# EAGLE design GPS_Shield (EAGLE 7.1.0)
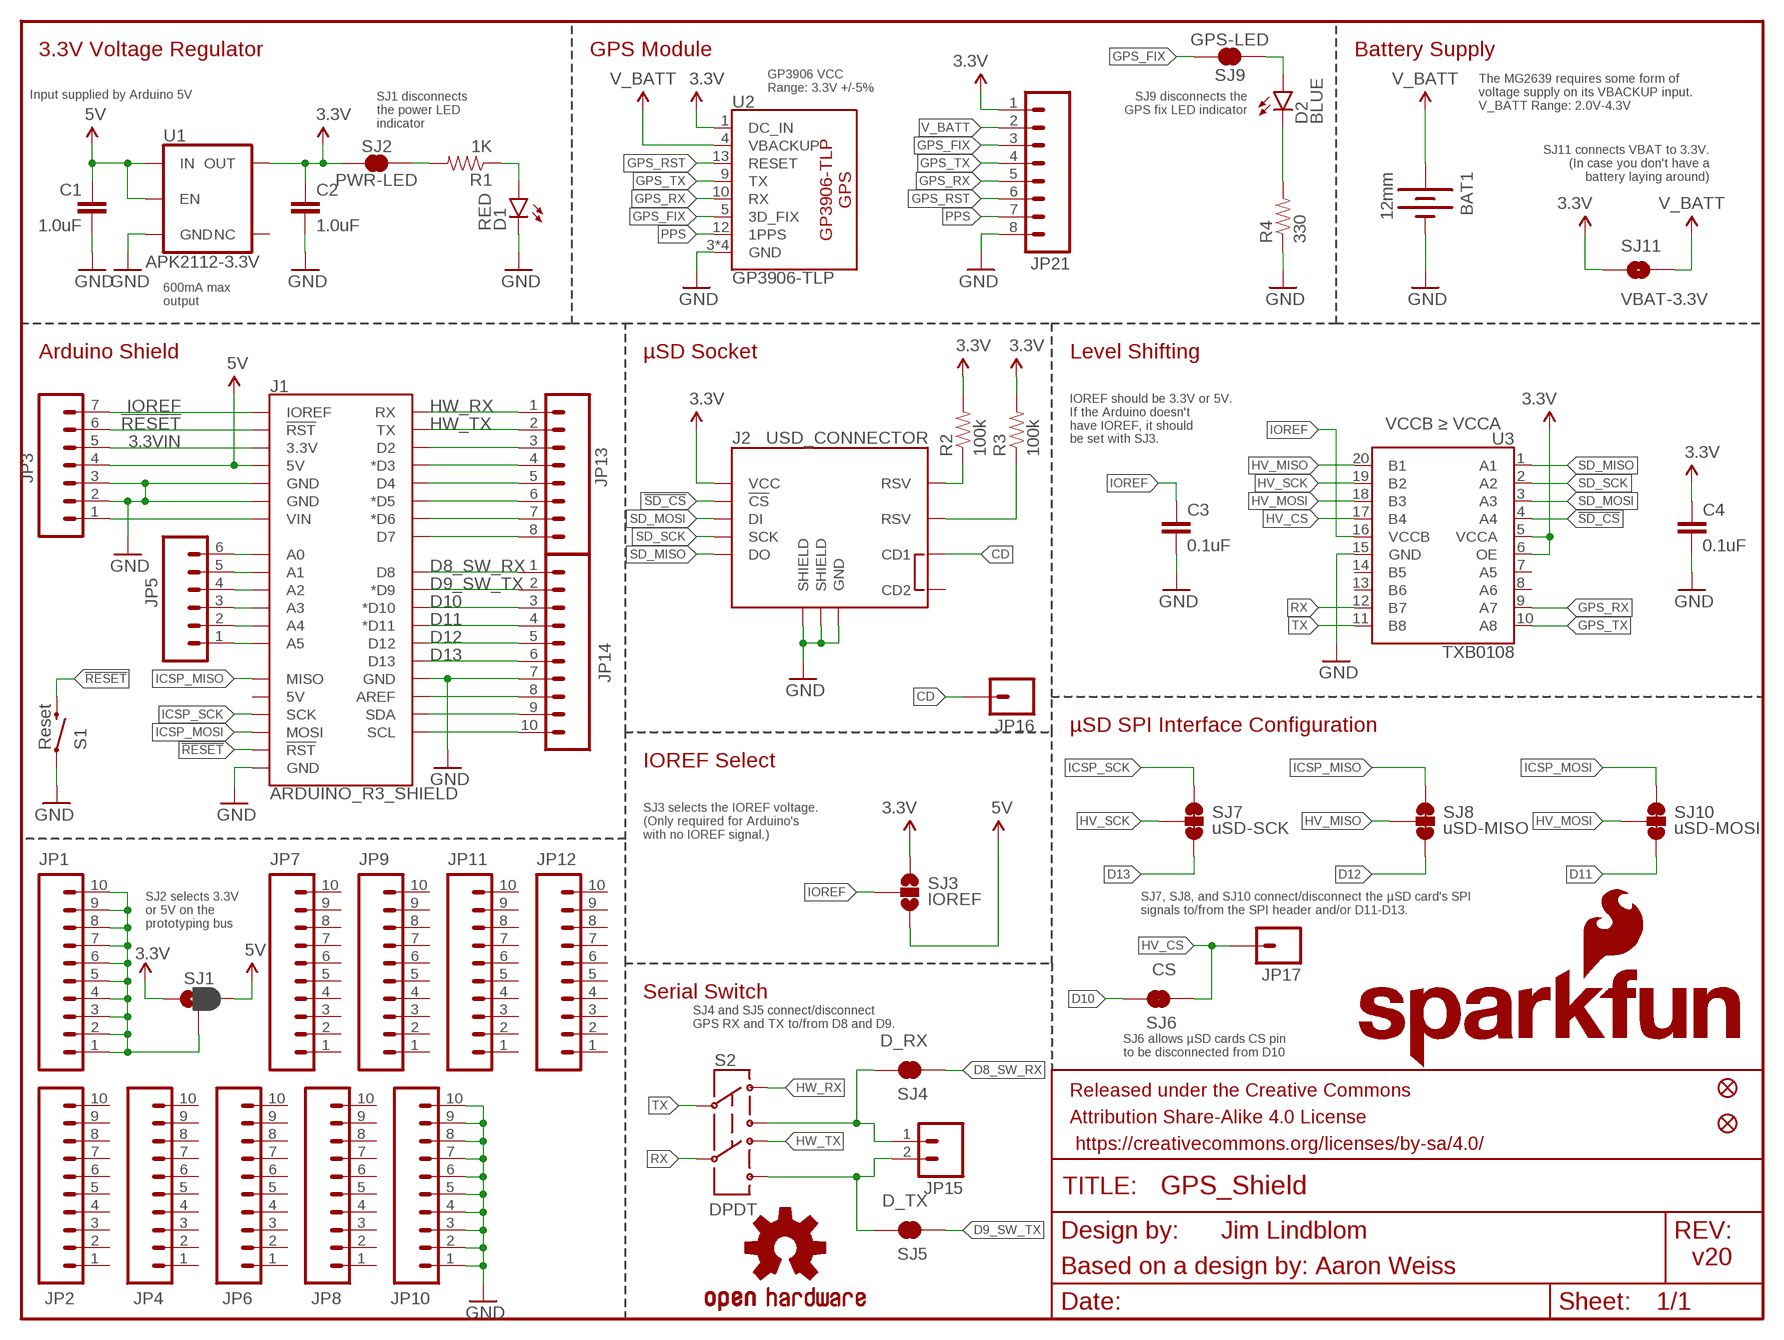
[diagram p0: schematic, sheet 1]

## Parts
BAT1  12mm  BATTERY12MM  [BATTCON_12MM]
C1  1.0uF  1.0UF-16V-10%(0603)  [0603-CAP]
C2  1.0uF  1.0UF-16V-10%(0603)  [0603-CAP]
C3  0.1uF  0.1UF-25V(+80/-20%)(0603)  [0603-CAP]
C4  0.1uF  0.1UF-25V(+80/-20%)(0603)  [0603-CAP]
D1  RED  LED-RED0603  [LED-0603]
D2  BLUE  LED-BLUE0603  [LED-0603]
FRAME1  FRAME-LETTER  [CREATIVE_COMMONS]
J1  ARDUINO_R3_SHIELD  ARDUINO_R3_SHIELD_ICSP-NO_LABELS  [UNO_R3_SHIELD_ICSP_NOLABELS]
J2  USD_CONNECTOR  [MICRO-SD-SOCKET-PP]
JP1  M10NO_SILK_PTH_FEMALE  [1X10_NO_SILK]
JP2  M10NO_SILK_PTH_FEMALE  [1X10_NO_SILK]
JP3  M07NO_SILK  [1X07_NO_SILK]
JP4  M10NO_SILK_PTH_FEMALE  [1X10_NO_SILK]
JP5  M06NO_SILK_FEMALE_PTH  [1X06_NO_SILK]
JP6  M10NO_SILK_PTH_FEMALE  [1X10_NO_SILK]
JP7  M10NO_SILK_PTH_FEMALE  [1X10_NO_SILK]
JP8  M10NO_SILK_PTH_FEMALE  [1X10_NO_SILK]
JP9  M10NO_SILK_PTH_FEMALE  [1X10_NO_SILK]
JP10  M10NO_SILK_PTH_FEMALE  [1X10_NO_SILK]
JP11  M10NO_SILK_PTH_FEMALE  [1X10_NO_SILK]
JP12  M10NO_SILK_PTH_FEMALE  [1X10_NO_SILK]
JP13  M08NO_SILK_FEMALE_PTH  [1X08_NO_SILK]
JP14  M10NO_SILK_PTH_FEMALE  [1X10_NO_SILK]
JP15  M021X02_NO_SILK  [1X02_NO_SILK]
JP16  M01PTH_NO_SILK_YES_STOP  [1X01_NO_SILK]
JP17  M01PTH_NO_SILK_YES_STOP  [1X01_NO_SILK]
JP19  FIDUCIAL1X2  [FIDUCIAL-1X2]
JP20  FIDUCIAL1X2  [FIDUCIAL-1X2]
JP21  M08NO_SILK_FEMALE_PTH  [1X08_NO_SILK]
LOGO1  OSHW-LOGOM  [OSHW-LOGO-M]
LOGO2  SFE_LOGO_NAME_FLAME.1_INCH  [SFE_LOGO_NAME_FLAME_.1]
R1  1K  1KOHM-1/10W-1%(0603)  [0603-RES]
R2  100k  100KOHM-1/10W-1%(0603)  [0603-RES]
R3  100k  100KOHM-1/10W-1%(0603)  [0603-RES]
R4  330  330OHM1/10W1%(0603)  [0603-RES]
S1  Reset  SWITCH-MOMENTARY-2SMD  [TACTILE-SWITCH-SMD]
S2  DPDT  SWITCH-DPDTAYZ0202  [AYZ0202]
SJ1  JUMPER-PAD-3-2OF3_NC_BY_PASTE  [PAD-JUMPER-3-2OF3_NC_BY_PASTE_YES_SILK_FULL_BOX]
SJ2  PWR-LED  JUMPER-PAD-2-NC_BY_TRACE  [PAD-JUMPER-2-NC_BY_TRACE_YES_SILK]
SJ3  IOREF  JUMPER-PAD-3-NOYES_SILK  [PAD-JUMPER-3-NO_YES_SILK]
SJ4  D_RX  JUMPER-PAD-2-NC_BY_TRACE  [PAD-JUMPER-2-NC_BY_TRACE_YES_SILK]
SJ5  D_TX  JUMPER-PAD-2-NC_BY_TRACE  [PAD-JUMPER-2-NC_BY_TRACE_YES_SILK]
SJ6  CS  JUMPER-PAD-2-NC_BY_TRACE  [PAD-JUMPER-2-NC_BY_TRACE_YES_SILK]
SJ7  uSD-SCK  JUMPER-PAD-3-NC_BY_TRACE  [PAD-JUMPER-3-3OF3_NC_BY_TRACE_YES_SILK_FULL_BOX]
SJ8  uSD-MISO  JUMPER-PAD-3-NC_BY_TRACE  [PAD-JUMPER-3-3OF3_NC_BY_TRACE_YES_SILK_FULL_BOX]
SJ9  GPS-LED  JUMPER-PAD-2-NC_BY_TRACE  [PAD-JUMPER-2-NC_BY_TRACE_YES_SILK]
SJ10  uSD-MOSI  JUMPER-PAD-3-NC_BY_TRACE  [PAD-JUMPER-3-3OF3_NC_BY_TRACE_YES_SILK_FULL_BOX]
SJ11  VBAT-3.3V  JUMPER-PAD-2-NOYES_SILK  [PAD-JUMPER-2-NO_YES_SILK]
U1  APK2112-3.3V  V_REG_AP2112K-3.3V  [SOT23-5]
U2  GP3906-TLP  [GP3906-TLP]
U3  TXB0108  [UFDFN-20]

## Nets
3.3V: C2.1 C4.1 J2.VCC JP21.1 R2.2 R3.2 SJ1.1 SJ2.1 SJ3.1 SJ11.1 U1.5(OUT) U2.1(DC_IN) U3.5(VCCA) U3.6(OE)
3.3VIN: J1.3.3V JP3.5
5V: C1.1 J1.5V JP3.4 SJ1.3 SJ3.3 U1.1(IN) U1.3(EN)
!RESET!: J1.RES(!RST!) J1.RST_ICSP(!RST!) JP3.6 S1.3
!SD_CS!: J2.CS(!CS) U3.4(A4)
CD: J2.CD1 JP16.1
D8_SW_RX: J1.D8 JP14.1 SJ4.1
D9_SW_TX: J1.D9(*D9) JP14.2 SJ5.1
D10: J1.D10(*D10) JP14.3 SJ6.2
D11: J1.D11(*D11) JP14.4 SJ10.3
D12: J1.D12 JP14.5 SJ8.3
D13: J1.D13 JP14.6 SJ7.3
GND: BAT1.GND(-) C1.2 C2.2 C3.2 C4.2 D1.C J1.GND@0(GND) J1.GND@1(GND) J1.GND@2(GND) J1.GND_ICSP(GND) J2.GND J2.GND1(SHIELD) J2.GND3(SHIELD) JP3.2 JP3.3 JP10.1 JP10.2 JP10.3 JP10.4 JP10.5 JP10.6 JP10.7 JP10.8 JP10.9 JP10.10 JP14.7 JP21.8 R4.1 S1.1 U1.2(GND) U2.3(GND) U2.8(GND) U2.11(GND) U2.20(GND) U3.15(GND)
GPS_FIX: JP21.3 SJ9.2 U2.5(3D_FIX)
GPS_RST: JP21.6 U2.13(RESET)
GPS_RX: JP21.5 U2.10(RX) U3.9(A7)
GPS_TX: JP21.4 U2.9(TX) U3.10(A8)
HV_CS: JP17.1 SJ6.1 U3.17(B4)
HV_MISO: SJ8.2 U3.20(B1)
HV_MOSI: SJ10.2 U3.18(B3)
HV_SCK: SJ7.2 U3.19(B2)
HW_RX: J1.RX JP13.1 S2.1
HW_TX: J1.TX JP13.2 S2.4
ICSP_MISO: J1.MISO SJ8.1
ICSP_MOSI: J1.MOSI SJ10.1
ICSP_SCK: J1.SCK SJ7.1
IOREF: C3.1 J1.IOREF JP3.7 SJ3.2 U3.16(VCCB)
N$1: D1.A R1.1
N$2: D2.C R4.2
N$3: J1.A5 JP5.1
N$4: J1.A4 JP5.2
N$5: J1.D2 JP13.3
N$6: J1.D3(*D3) JP13.4
N$7: J1.D4 JP13.5
N$8: J1.D5(*D5) JP13.6
N$9: J1.D6(*D6) JP13.7
N$10: J1.D7 JP13.8
N$11: J1.A3 JP5.3
N$12: J1.A2 JP5.4
N$13: J1.A1 JP5.5
N$14: J1.A0 JP5.6
N$15: R1.2 SJ2.2
N$16: JP1.1 JP1.2 JP1.3 JP1.4 JP1.5 JP1.6 JP1.7 JP1.8 JP1.9 JP1.10 SJ1.2
N$17: D2.A SJ9.1
N$18: J2.RSV1(RSV) R2.1
N$19: J2.RSV2(RSV) R3.1
N$20: J1.AREF JP14.8
N$21: J1.SDA JP14.9
N$22: J1.SCL JP14.10
N$24: J1.VIN JP3.1
N$121: JP15.2 S2.6 SJ5.2
N$122: JP15.1 S2.3 SJ4.2
PPS: JP21.7 U2.12(1PPS)
RX: S2.5 U3.12(B7)
SD_MISO: J2.DO U3.1(A1)
SD_MOSI: J2.DI U3.3(A3)
SD_SCK: J2.SCLK(SCK) U3.2(A2)
TX: S2.2 U3.11(B8)
V_BATT: BAT1.PWR@1(+) JP21.2 SJ11.2 U2.4(VBACKUP)
Unconnected: J1.5V_ICSP(5V) J2.CD2 JP2.1 JP2.2 JP2.3 JP2.4 JP2.5 JP2.6 JP2.7 JP2.8 JP2.9 JP2.10 JP4.1 JP4.2 JP4.3 JP4.4 JP4.5 JP4.6 JP4.7 JP4.8 JP4.9 JP4.10 JP6.1 JP6.2 JP6.3 JP6.4 JP6.5 JP6.6 JP6.7 JP6.8 JP6.9 JP6.10 JP7.1 JP7.2 JP7.3 JP7.4 JP7.5 JP7.6 JP7.7 JP7.8 JP7.9 JP7.10 JP8.1 JP8.2 JP8.3 JP8.4 JP8.5 JP8.6 JP8.7 JP8.8 JP8.9 JP8.10 JP9.1 JP9.2 JP9.3 JP9.4 JP9.5 JP9.6 JP9.7 JP9.8 JP9.9 JP9.10 JP11.1 JP11.2 JP11.3 JP11.4 JP11.5 JP11.6 JP11.7 JP11.8 JP11.9 JP11.10 JP12.1 JP12.2 JP12.3 JP12.4 JP12.5 JP12.6 JP12.7 JP12.8 JP12.9 JP12.10 U1.4(NC) U3.7(A5) U3.8(A6) U3.13(B6) U3.14(B5)

## Notes on the sheet
- 3.3V Voltage Regulator | GPS Module | Battery Supply
- The MG2639 requires some form of 
  voltage supply on its VBACKUP input.
  V_BATT Range: 2.0V-4.3V
- GP3906 VCC 
  Range: 3.3V +/-5%
- SJ9 disconnects the
  GPS fix LED indicator
- Input supplied by Arduino 5V
- SJ1 disconnects 
  the power LED 
  indicator
- SJ11 connects VBAT to 3.3V.
  (In case you don't have a
   battery laying around)
- 600mA max
  output
- Arduino Shield | µSD Socket | Level Shifting
- IOREF should be 3.3V or 5V.
  If the Arduino doesn't
  have IOREF, it should
  be set with SJ3.
- VCCB ≥ VCCA
- µSD SPI Interface Configuration
- IOREF Select
- SJ3 selects the IOREF voltage.
  (Only required for Arduino's
  with no IOREF signal.)
- SJ2 selects 3.3V
  or 5V on the
  prototyping bus
- SJ7, SJ8, and SJ10 connect/disconnect the µSD card's SPI 
  signals to/from the SPI header and/or D11-D13.
- Serial Switch
- SJ4 and SJ5 connect/disconnect 
  GPS RX and TX to/from D8 and D9.
- SJ6 allows µSD cards CS pin 
  to be disconnected from D10
- Jim Lindblom
- v20
- Based on a design by: Aaron Weiss

## Library data of the parts
BAT1 = SparkFun-Electromechanical:BATTERY: Battery Holders Various common sizes : AA, AAA, 18650 (PRT-12895), 20mm coin cell and 12mm coin cell. 20MM_4LEGS, BATT-10373; PROD_ID: BATT-08044
C1 C2 = SparkFun-Capacitors:1.0UF-16V-10%(0603): CAP-00868; PROD_ID: CAP-00868
C3 C4 = SparkFun-Capacitors:0.1UF-25V(+80/-20%)(0603): CAP-00810 Ceramic Standard decoupling cap; PROD_ID: CAP-00810
D1 = SparkFun-LED:LED-RED: Assorted Red LEDs LilyPad 1206- DIO-09912 1206- DIO-00809 0603- DIO-00819 "SMART" means more efficient and expensive; PROD_ID: DIO-00819
D2 = SparkFun-LED:LED-BLUE: Blue LEDs for production use Various blue LEDs stocked by SparkFun production 0603 - DIO-08575 Rebel - DIO-09553 1206 - DIO-09911; PROD_ID: DIO-08575
FRAME1 = SparkFun-Aesthetics:FRAME-LETTER: Schematic Frame Standard 8.5x11 US Letter frame
J1 = SparkFun-Boards:ARDUINO_R3_SHIELD_ICSP: Arduino R3 Shield Footprint w/ 6-pin (2x3) ICSP Header
J2 = SparkFun-Connectors:USD_CONNECTOR: microSD Socket Push-push type µSD socket. Footprint production proven. Symbol has new and improved layout and naming accuracy. SparkFun Electronics SKU : PRT-00127. tDoc lines correctly indicate media card edge positions when inserting (unlocked, locked, depressed). NOTE: CD1 and CD2 are connected internally; PROD_ID: CONN-07820
JP1 JP2 JP4 JP6-JP12 JP14 = SparkFun-Connectors:M10: Header 10 Standard 10-pin 0.1" header. Use with straight break away headers (SKU : PRT-00116), right angle break away headers (PRT-00553), swiss pins (PRT-00743), machine pins (PRT-00117), and female headers (PRT-00115).; PROD_ID: CONN-11563
JP3 = SparkFun-Connectors:M07: Header 7 Standard 7-pin 0.1" header. Use with straight break away headers (SKU : PRT-00116), right angle break away headers (PRT-00553), swiss pins (PRT-00743), machine pins (PRT-00117), and female headers (PRT-00115). NOTES ON THE VARIANTS LOCK and LOCK_LONGPADS... This footprint was designed to help hold the alignment of a through-hole component (i.e. 7-pin header) while soldering it into place. You may notice that each hole has been shifted either up or down by 0.005 of an inch from it's more standard position (which is usually a perfectly straight line). This slight alteration caused the pins (the squares in the middle) to touch the edges of the holes. Because they are alternating, it causes a "brace" to hold the header in place. 0.005 has proven to be the perfect amount of "off-center" position when using our standard breakaway headers. Although looks a little odd when you look at the bare footprint, once you have a header in there, the alteration is very hard to notice. Also, if you push a header all the way into place, it is covered up entirely on the bottom side. This idea of altering the position of holes to aid alignment will be further integrated into the Sparkfun Library for other footprints. It can help hold any component with 3 or more connection pins.
JP5 = SparkFun-Connectors:M06: Header 6 Standard 6-pin 0.1" header. Use with straight break away headers (SKU : PRT-00116), right angle break away headers (PRT-00553), swiss pins (PRT-00743), machine pins (PRT-00117), and female headers (PRT-00115). Molex polarized connector foot print use with SKU : PRT-08094 with associated crimp pins and housings. NOTES ON THE VARIANTS LOCK and LOCK_LONGPADS... This footprint was designed to help hold the alignment of a through-hole component (i.e. 6-pin header) while soldering it into place. You may notice that each hole has been shifted either up or down by 0.005 of an inch from it's more standard position (which is a perfectly straight line). This slight alteration caused the pins (the squares in the middle) to touch the edges of the holes. Because they are alternating, it causes a "brace" to hold the component in place. 0.005 has proven to be the perfect amount of "off-center" position when using our standard breakaway headers. Although looks a little odd when you look at the bare footprint, once you have a header in there, the alteration is very hard to notice. Also,if you push a header all the way into place, it is covered up entirely on the bottom side. This idea of altering the position of holes to aid alignment will be further integrated into the Sparkfun Library for other footprints. It can help hold any component with 3 or more connection pins.; PROD_ID: CONN-08437
JP13 JP21 = SparkFun-Connectors:M08: Header 8 Standard 8-pin 0.1" header. Use with straight break away headers (SKU : PRT-00116), right angle break away headers (PRT-00553), swiss pins (PRT-00743), machine pins (PRT-00117), and female headers (PRT-00115).; PROD_ID: CONN-08438
JP15 = SparkFun-Connectors:M02: Standard 2-pin 0.1" header. Use with - straight break away headers ( PRT-00116) - right angle break away headers (PRT-00553) - swiss pins (PRT-00743) - machine pins (PRT-00117) - female headers (PRT-00115) Molex polarized connector foot print use with: PRT-08233 with associated crimp pins and housings. 2.54_SCREWTERM for use with PRT-10571. 3.5mm Screw Terminal footprints for PRT-08084 5mm Screw Terminal footprints for use with PRT-08432
JP16 JP17 = SparkFun-Connectors:M01: Header 1 Standard 1-pin 0.1" header. Use with straight break away headers (SKU : PRT-00116), right angle break away headers (PRT-00553), swiss pins (PRT-00743), machine pins (PRT-00117), and female headers (PRT-00115). SMTSO-256-ET is a "flush mount" nut for a 4-40 screw. The older package used to be too tight, and did not allow it to sit properly thru the drill hit. The latest (0.165DIA) fits nice and snug.
JP19 JP20 = SparkFun:FIDUCIAL: Fiducial Alignment Points Various fiducial points for machine vision alignment.
LOGO1 = SparkFun-Aesthetics:OSHW-LOGO: Open Source Hardware Logo This logo indicates the piece of hardware it is found on incorporates a OSHW license and/or adheres to the definition of open source hardware found here: http://freedomdefined.org/OSHW
LOGO2 = SparkFun-Aesthetics:SFE_LOGO_NAME_FLAME: SFE Logo, name and flame This is the SparkFun full logo. The logo on the schematic will always be the same size; the package variant is the height of the flame part of the logo. Default layer for the logo on the board is tSilk.
R1 = SparkFun-Resistors:1KOHM-1/10W-1%(0603): RES-07856; PROD_ID: RES-07856
R2 R3 = SparkFun-Resistors:100KOHM-1/10W-1%(0603): RES-07828; PROD_ID: RES-07828
R4 = SparkFun-Resistors:330OHM1/10W1%(0603): RES-00818; PROD_ID: RES-00818
S1 = SparkFun-Electromechanical:SWITCH-MOMENTARY-2: Various NO switches- pushbuttons, reed, etc; PROD_ID: SWCH-08247
S2 = SparkFun-Electromechanical:SWITCH-DPDT: DPDT Version of the COM-00597; PROD_ID: SWCH-08179
SJ1 = SparkFun-Passives:JUMPER-PAD-3-2OF3_NC_BY_PASTE
SJ2 SJ4-SJ6 SJ9 = SparkFun-Passives:JUMPER-PAD-2-NC_BY_TRACE
SJ3 = SparkFun-Passives:JUMPER-PAD-3-NO
SJ7 SJ8 SJ10 = SparkFun-Passives:JUMPER-PAD-3-NC_BY_TRACE
SJ11 = SparkFun-Passives:JUMPER-PAD-2-NO
U1 = SparkFun-PowerIC:V_REG_AP2112: AP2112 - 600mA CMOS LDO Regulator w/ Enable The AP2112 is CMOS process low dropout linear regulator with enable function, the regulator delivers a guaranteed 600mA (min.) continuous load current. Features Output Voltage Accuracy: ±1.5% Output Current: 600mA (Min.) Foldback Short Current Protection: 50mA Enable Function to Turn ON/OFF VOUT Low Dropout Voltage (3.3V): 250mV (Typ.) @IOUT=600mA Excellent Load Regulation: 0.2%/A (Typ.) Excellent Line Regulation: 0.02%/V (Typ.) Low Quiescent Current: 55μA (Typ.) Low Standby Current: 0.01μA (Typ.) Low Output Noise: 50μVRMS PSRR: 100Hz -65dB, 1kHz -65dB OTSD Protection Stable with 1.0μF Flexible Cap: Ceramic, Tantalum and Aluminum Electrolytic Operation Temperature Range: -40°C to 85°C ESD: MM 400V, HBM 4000V; PROD_ID: VREG-12457; VALUE: 3.3V
U2 = gps-shield-temp:GP3906-TLP: GP3906-TLP PoT GPS Module The GP3906-TLP is a POT (Patch on Top) GPS module which is special designed for ultra low power consumption purpose environment. It is a GPS receiver providing a solution that high position and speed accuracy performances as well as high sensitivity and tracking capabilities in urban conditions. The GPS chipsets inside the module are designed by MediaTek Inc., which is the world's leading digital media solution provider and largest fab-less IC company in Taiwan. The module can support up to 66 channels. The GPS solution enables small form factor devices. They deliver major advancements in GPS performances, accuracy, integration, computing power and flexibility. They are designed to simplify the embedded system integration process. Features: Based on MediaTek Single Chip Architecture (MT3339). ARM7 based application processor High sensitivity: -165dBm tracking L1 frequency, C/A code Channels: 66 acquisition, 22 simultaneous tracking Low power consumption: 26mA @ acquisition, 20mA @ tracking Cold/Warm/Hot start time: <35/<33/<1 seconds Maximum update rate up to 10Hz GPS data interface: TTL level serial port Support NMEA 0183 standard V3.01 and backward compliance Support SBAS – WAAS, EGNOS, GAGAN and MSAS Dimension：16mm x 16mm x 6.7mm RoHS compliant Advanced software features AlwaysLocate TM advanced location awareness technology EPO TM orbit prediction Supports logger function (LOCUS); PROD_ID: GPS-13174
U3 = SparkFun-DigitalIC:TXB0108: 8-Bit Bi-Directional Level Shifter 1.2V-3.6V (VCCA) to 1.65V-5.5V (VCCB) bi-directional level shifter with auto direction sensing. Max data rate - VCCA 1.2V: 20Mbps (50ns), VCCA 3.3V: 100Mbps (10ns) Digikey: 296-27217-1-ND (20-UFDFN) IC-12292; PROD_ID: IC-12292

## Board
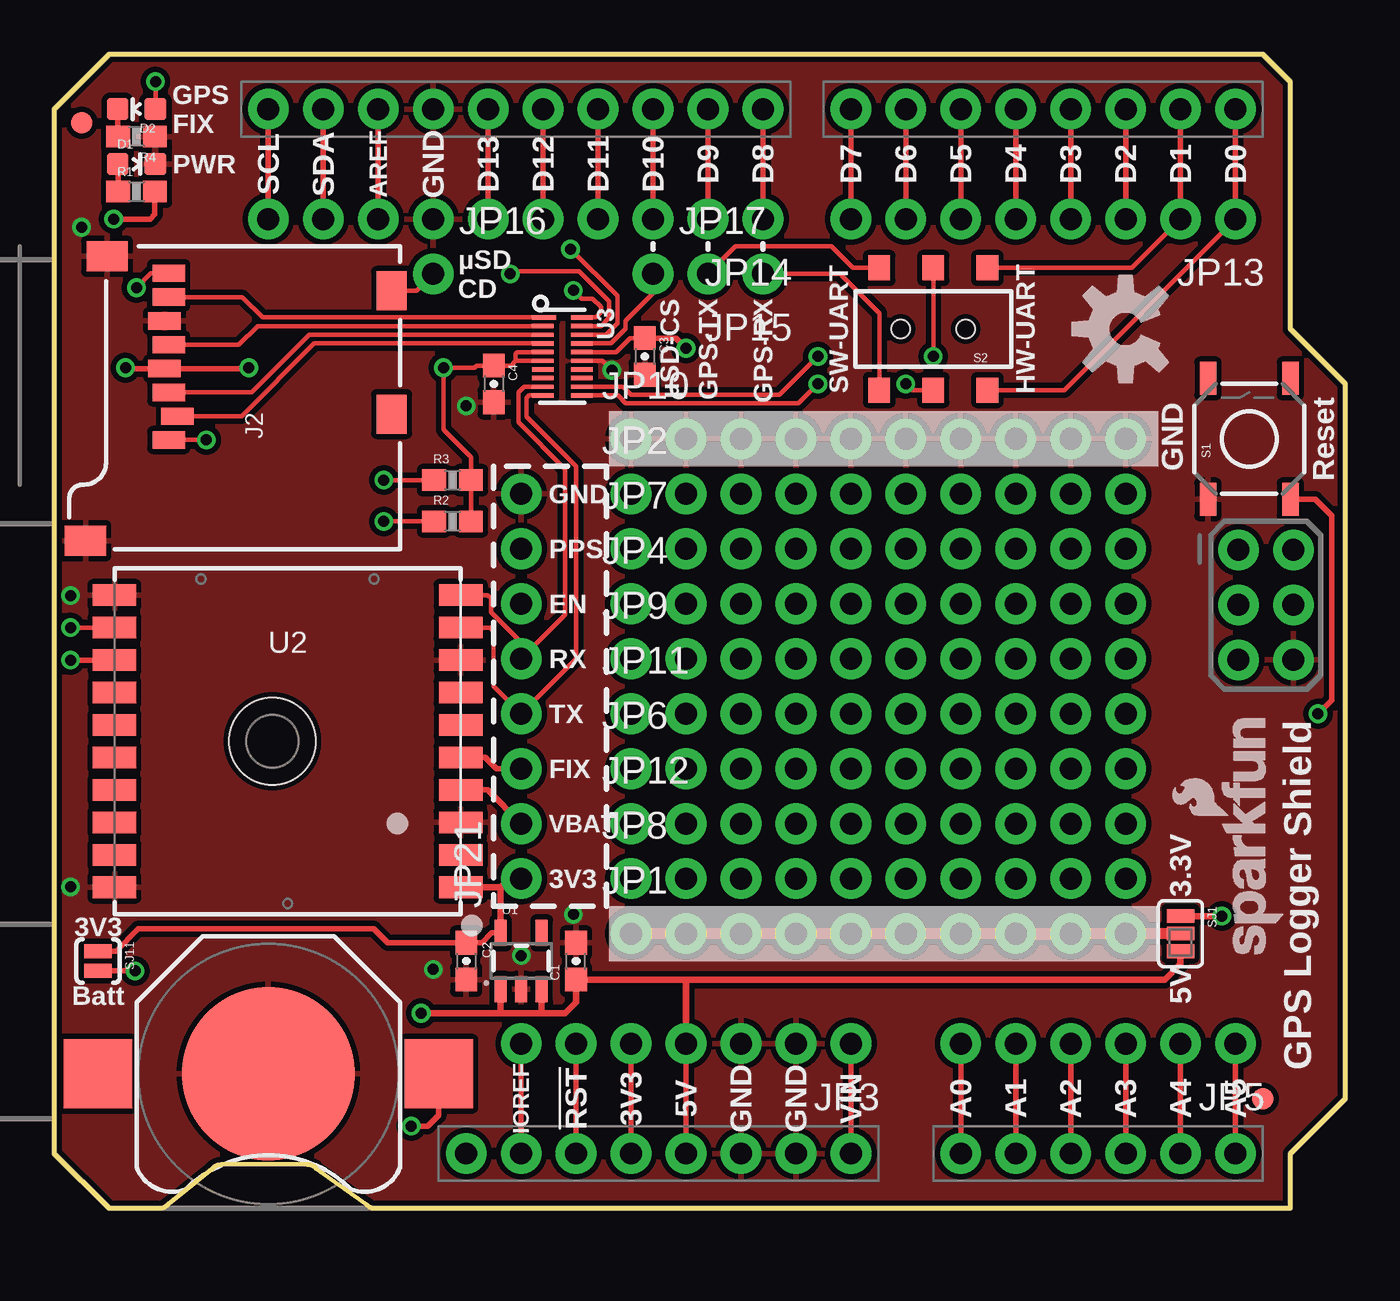
[diagram p1: board, top side]
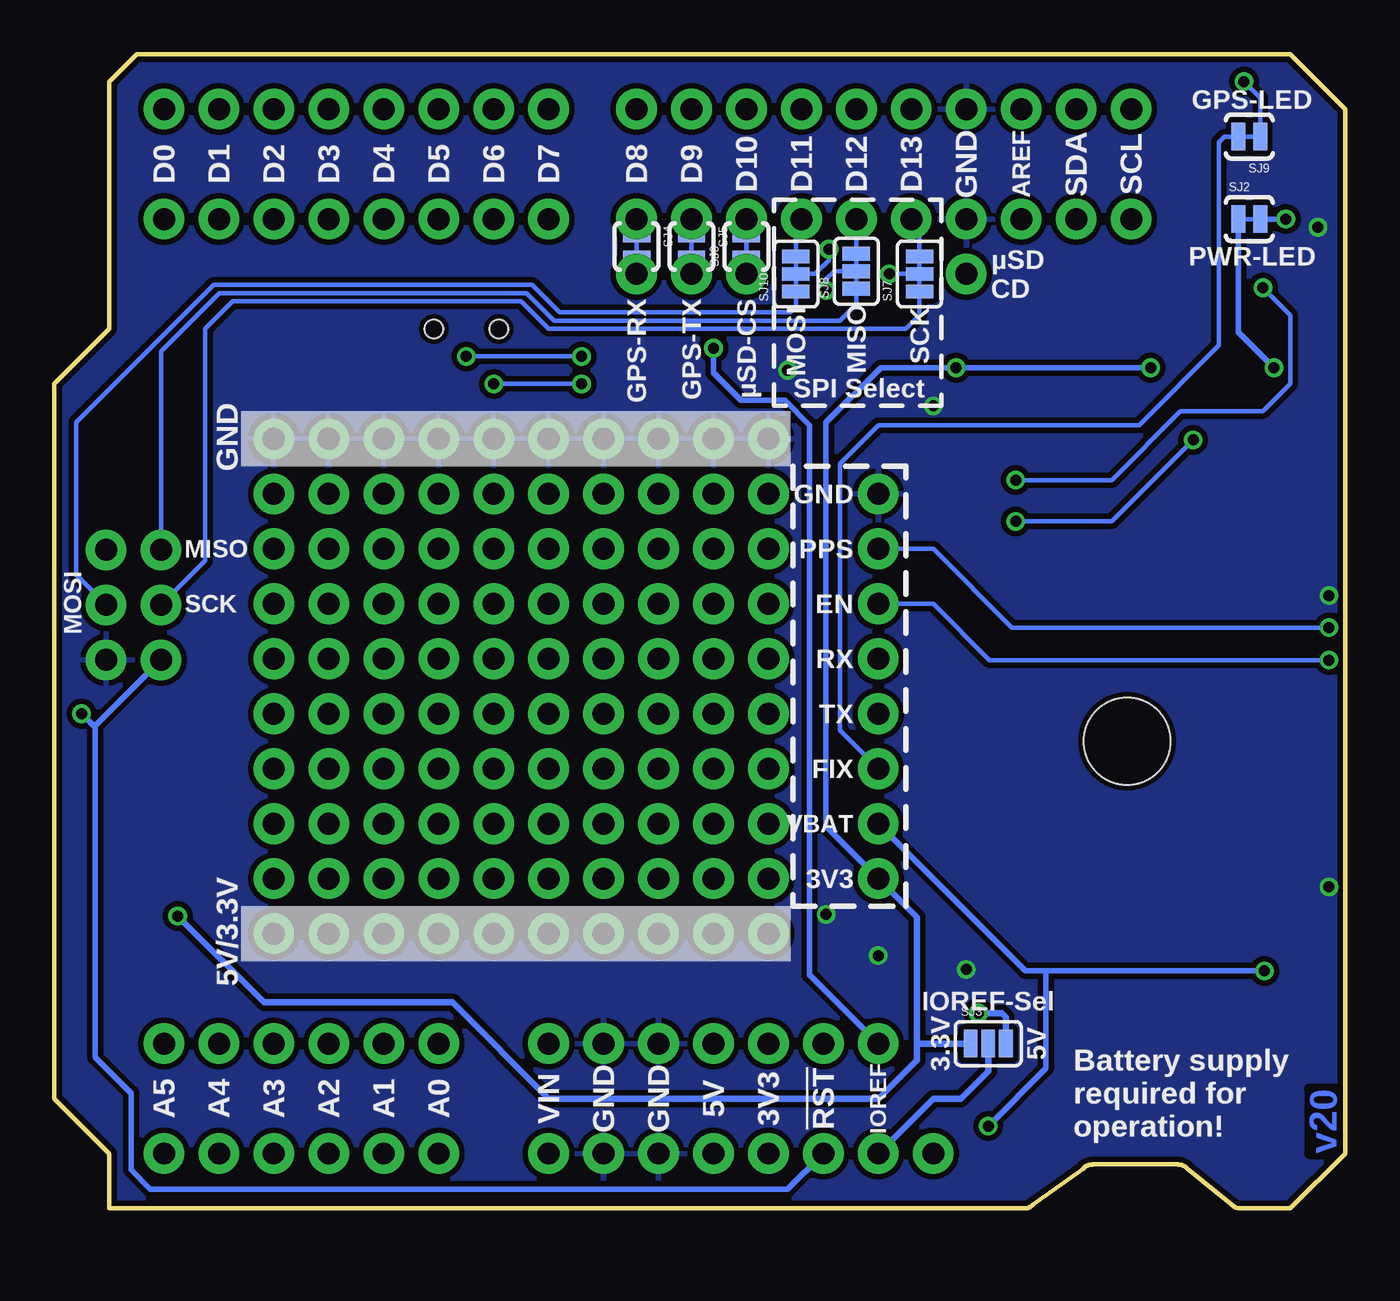
[diagram p2: board, bottom side, seen from below]

Size 59.69 x 53.34 mm. Coordinates in mm from the lower left corner, seen from the top.
Outline: 0,50.8 2.54,53.34 55.88,53.34 57.15,52.07 57.15,40.64 59.69,38.1 59.69,5.08 57.15,2.54 57.15,0 14.87,0 arc-45 14.42,0.19 12.12,1.85 arc45 11.68,2.03 7.76,2.03 arc45 7.31,1.85 5.27,0.19 arc-45 4.82,0 2.54,0 0,2.54 0,50.8
Copper layers (1*16): Top 0.035mm / dielectric 1.5mm / Bottom 0.035mm
Design rules "SparkFun-2-layer-TIGHT": minimum track width 7mil, minimum drill 15mil, track to track 7mil, track to pad 7mil, pad to pad 7mil, via to via 7mil, smd to smd 7mil, copper to edge 7mil, drill to drill 7mil, minimum pad ring 7mil, minimum via ring 7mil, stop-mask expansion 4mil, vias tented up to drill 20mil, thermal gap 10mil

### Footprints (pad centres in the part's own frame; a part is rotated, then mirrored left to right if it is on the bottom)
BATTCON_12MM = smd 8 x 8: GND 0,0 | smd 3.175 x 3.175: PWR@1 -7.874,0; PWR@2 7.874,0
0603-CAP = smd 1.1 x 1: 1 -0.85,0; 2 0.85,0
LED-0603 = smd 1 x 1: A 0,-0.877; C 0,0.877
UNO_R3_SHIELD_ICSP_NOLABELS = drill 1.016 pad 1.88: 3.3V 50.8,26.67; 5V 50.8,29.21; 5V_ICSP 22.91,57.29; A0 50.8,41.91; A1 50.8,44.45; A2 50.8,46.99; A3 50.8,49.53; A4 50.8,52.07; A5 50.8,54.61; AREF 2.54,14.986; D2 2.54,49.53; D3 2.54,46.99; D4 2.54,44.45; D5 2.54,41.91; D6 2.54,39.37; D7 2.54,36.83; D8 2.54,32.766; D9 2.54,30.226; D10 2.54,27.686; D11 2.54,25.146; D12 2.54,22.606; D13 2.54,20.066; GND@0 50.8,31.75; GND@1 50.8,34.29; GND@2 2.54,17.526; GND_ICSP 27.99,57.29; IOREF 50.8,21.59; MISO 22.91,54.75; MOSI 25.45,57.29; NC 50.8,19.05; RES 50.8,24.13; RST_ICSP 27.99,54.75; RX 2.54,54.61; SCK 25.45,54.75; SCL 2.54,9.906; SDA 2.54,12.446; TX 2.54,52.07; VIN 50.8,36.83
MICRO-SD-SOCKET-PP = smd 1.8 x 1.4: CD1 -2.05,0.4; CD2 -7.75,0.4 | smd 0.8 x 1.5: CS -7.84,10.3; DI -6.74,10.7; DO -2.34,10.7; GND -3.44,10.9; RSV1 -8.94,10.7; RSV2 -1.24,10.7; SCLK -4.54,10.7; VCC -5.64,10.9 | smd 1.4 x 1.9: GND1 -13.6,14.55; GND3 -0.45,13.55
1X10_NO_SILK = drill 1.016 pad 1.88: 1 0,0; 2 2.54,0; 3 5.08,0; 4 7.62,0; 5 10.16,0; 6 12.7,0; 7 15.24,0; 8 17.78,0; 9 20.32,0; 10 22.86,0
1X07_NO_SILK = drill 1.016 pad 1.88: 1 0,0; 2 2.54,0; 3 5.08,0; 4 7.62,0; 5 10.16,0; 6 12.7,0; 7 15.24,0
1X06_NO_SILK = drill 1.016 pad 1.88: 1 0,0; 2 2.54,0; 3 5.08,0; 4 7.62,0; 5 10.16,0; 6 12.7,0
1X08_NO_SILK = drill 1.016 pad 1.88: 1 0,0; 2 2.54,0; 3 5.08,0; 4 7.62,0; 5 10.16,0; 6 12.7,0; 7 15.24,0; 8 17.78,0
1X02_NO_SILK = drill 1.016 pad 1.88: 1 0,0; 2 2.54,0
1X01_NO_SILK = drill 1.016 pad 1.88: 1 0,0
FIDUCIAL-1X2 = smd 1 x 1: 1 0,0
0603-RES = smd 1.1 x 1: 1 -0.85,0; 2 0.85,0
TACTILE-SWITCH-SMD = smd 1.524 x 0.762: 1 -2.794,1.905; 2 2.794,1.905; 3 -2.794,-1.905; 4 2.794,-1.905
AYZ0202 = smd 1 x 1.15: 1 -2.5,2.825; 2 0,2.825; 3 2.5,2.825; 4 -2.5,-2.825; 5 0,-2.825; 6 2.5,-2.825 | hole 0.85: 1.5,0; -1.5,0
PAD-JUMPER-3-2OF3_NC_BY_PASTE_YES_SILK_FULL_BOX = smd 0.635 x 1.27: 1 -0.813,0; 2 0,0; 3 0.813,0
PAD-JUMPER-2-NC_BY_TRACE_YES_SILK = smd 0.635 x 1.27: 1 -0.508,0; 2 0.508,0
PAD-JUMPER-3-NO_YES_SILK = smd 0.635 x 1.27: 1 -0.813,0; 2 0,0; 3 0.813,0
PAD-JUMPER-3-3OF3_NC_BY_TRACE_YES_SILK_FULL_BOX = smd 0.635 x 1.27: 1 -0.813,0; 2 0,0; 3 0.813,0
PAD-JUMPER-2-NO_YES_SILK = smd 0.635 x 1.27: 1 -0.45,0; 2 0.45,0
SOT23-5 = smd 0.55 x 1.2: 1 -0.95,-1.3; 2 0,-1.3; 3 0.95,-1.3; 4 0.95,1.3; 5 -0.95,1.3
GP3906-TLP = smd 2 x 1: 1 8,-6.75; 2 8,-5.25; 3 8,-3.75; 4 8,-2.25; 5 8,-0.75; 6 8,0.75; 7 8,2.25; 8 8,3.75; 9 8,5.25; 10 8,6.75; 11 -8,6.75; 12 -8,5.25; 13 -8,3.75; 14 -8,2.25; 15 -8,0.75; 16 -8,-0.75; 17 -8,-2.25; 18 -8,-3.75; 19 -8,-5.25; 20 -8,-6.75 | hole 4: -0.7,0
UFDFN-20 = smd 0.2 x 1.1: 1 -1.8,-0.85 | smd 0.2 x 1: 2 -1.4,-0.9; 3 -1,-0.9; 4 -0.6,-0.9; 5 -0.2,-0.9; 6 0.2,-0.9; 7 0.6,-0.9; 8 1,-0.9; 9 1.4,-0.9; 10 1.8,-0.9; 11 1.8,0.9; 12 1.4,0.9; 13 1,0.9; 14 0.6,0.9; 15 0.2,0.9; 16 -0.2,0.9; 17 -0.6,0.9; 18 -1,0.9; 19 -1.4,0.9; 20 -1.8,0.9

### Placement (x,y rotation side)
BAT1  9.91,6.22 180 top
C1  24.13,11.43 90 top
C2  19.05,11.43 270 top
C3  27.3,39.37 270 top
C4  20.32,38.1 270 top
D1  3.81,48.26 270 top
D2  3.81,50.8 90 top
FRAME1  -3.81,-20.32 0 top  (outside the outline)
J1  0,53.34 270 top
J2  16,44.45 90 top
JP1  26.67,12.7 0 top
JP2  26.67,33.02 0 top
JP3  36.83,7.62 180 top
JP4  26.67,27.94 0 top
JP5  54.61,7.62 180 top
JP6  26.67,20.32 0 top
JP7  26.67,30.48 0 top
JP8  26.67,15.24 0 top
JP9  26.67,25.4 0 top
JP10  26.67,35.56 0 top
JP11  26.67,22.86 0 top
JP12  26.67,17.78 0 top
JP13  54.61,45.72 180 top
JP14  32.77,45.72 180 top
JP15  32.77,43.18 180 top
JP16  17.53,43.18 0 top
JP17  27.69,43.18 0 top
JP19  1.27,50.16 270 top
JP20  55.88,5.08 270 top
JP21  21.59,15.24 90 top
LOGO1  49.53,40.64 90 top
LOGO2  56.9,11.3 90 top
R1  3.81,46.99 0 top
R2  18.41,31.75 0 top
R3  18.41,33.66 0 top
R4  3.81,49.53 180 top
S1  55.24,35.56 90 top
S2  40.64,40.64 180 top
SJ1  52.07,12.7 270 top
SJ2  4.45,45.72 0 bottom
SJ3  16.51,7.62 0 bottom
SJ4  32.77,44.45 270 bottom
SJ5  30.23,44.45 270 bottom
SJ6  27.69,44.45 90 bottom
SJ7  19.68,43.18 90 bottom
SJ8  22.61,43.31 90 bottom
SJ9  4.45,49.53 180 bottom
SJ10  25.4,43.18 90 bottom
SJ11  2.03,11.43 270 top
U1  21.59,11.43 0 top
U2  10.79,21.59 0 top
U3  23.5,39.37 270 top

### Tracks (layer width: path | path; a pad name or v marks a point on that pad's centre or on a via)
3.3V  (via drill 0.51)
  Top 0.203: U3.6 21.34,39.17 | U3.5 21.41,39.57 21.34,39.5 21.34,39.17 | 21.34,39.17 21.12,38.95 C4.1 19.53,38.95 19.43,38.85 v18,38.85 18,35.98 19.27,34.71 R3.2 R2.2
  Top 0.254: U1.5 20.22,12.73 19.77,12.28 C2.1 | C2.1 18.89,12.45 | v9,38.85 8.96,38.81 J2.VCC 3.34,38.81 v3.3,38.85 | C2.1 15.41,12.28 14.77,12.91 3.9,12.91 2.86,11.88 SJ11.1
  Top 0.305: SJ1.1 v53.98,13.51 | U2.1 20.64,14.84 | 20.64,14.84 U1.5 | 20.64,14.84 21.04,15.24 JP21.1
  Bottom 0.254: v9,38.85 v18,38.85 21.48,38.85 24,36.32 24,17.65 JP21.1 | v3.3,38.85 4.95,40.5 SJ2.1
  Bottom 0.305: v53.98,13.51 49.99,9.53 41.27,9.53 36.83,5.08 21.59,5.08 19.81,6.86 19.81,7.62 | 19.81,7.62 19.81,13.46 JP21.1 | SJ3.1 19.81,7.62
3.3VIN
  Top 0.254: J1.3.3V JP3.5
5V  (via drill 0.51)
  Top 0.254: J1.5V JP3.4
  Top 0.305: 29.21,10.58 C1.1 24.13,9.53 23.62,9.02 22.54,9.02 | 29.21,10.58 51.35,10.58 52.07,11.3 SJ1.3 | JP3.4 29.21,10.58 | 22.54,9.02 20.64,9.02 | 20.64,9.02 v16.97,9.02 | U1.1 20.64,9.02 | U1.3 22.54,9.02
  Bottom 0.305: SJ3.3 15.7,8.84 15.88,9.02 v16.97,9.02
!RESET!  (via drill 0.51)
  Top 0.254: J1.RES JP3.6 | S1.3 58.29,32.77 59.05,32 59.05,23.5 v58.42,22.86
  Bottom 0.254: J1.RES 25.78,0.89 55.24,0.89 56.13,1.78 56.13,5.33 57.78,6.99 57.78,22.23 | 57.78,22.23 57.78,22.32 J1.RST_ICSP | v58.42,22.86 57.78,22.23
!SD_CS!
  Top 0.203: U3.4 12.03,39.97 8.67,36.61 J2.CS
CD
  Top 0.203: J2.CD1 16.75,42.4 JP16.1
D8_SW_RX
  Top 0.254: JP14.1 J1.D8
  Bottom 0.203: SJ4.1 JP14.1
D9_SW_TX
  Top 0.254: JP14.2 J1.D9
  Bottom 0.203: SJ5.1 JP14.2
D10
  Top 0.254: JP14.3 J1.D10
  Bottom 0.203: SJ6.2 JP14.3
D11
  Top 0.254: JP14.4 J1.D11
  Bottom 0.203: SJ10.3 25.4,45.47 JP14.4
D12
  Top 0.254: JP14.5 J1.D12
  Bottom 0.203: SJ8.3 JP14.5
D13
  Top 0.254: JP14.6 J1.D13
  Bottom 0.203: SJ7.3 19.68,45.34 JP14.6
GND  (via drill 0.51)
  Top 0.203: U3.15 25.35,39.17 v25.78,38.73
  other vias: 19.05,37.08 21.59,11.68 17.53,11.05 24,13.59 0.76,14.86 0.76,28.32 1.27,45.34
  pour Top (isolate 0.254): 0,53.34 59.69,53.34 59.69,0 0,0
  pour Bottom (isolate 0.254): 0,53.34 59.69,53.34 59.69,0 0,0
GPS_FIX
  Top 0.254: JP21.3 20.45,20.32 19.93,20.84 U2.5
  Bottom 0.203: JP21.3 23.37,22.1 23.37,34.42 21.59,36.2 9.53,36.2 5.84,39.88 5.84,49.28 5.59,49.53 SJ9.2
GPS_RST  (via drill 0.51)
  Top 0.254: U2.13 v0.76,25.34
  Bottom 0.203: v0.76,25.34 16.45,25.34 19.05,27.94 JP21.6
GPS_RX
  Top 0.203: U3.9 21.71,37.97 21.46,37.72 21.46,36.32 23.62,34.16 23.62,27.43 JP21.5 21.59,26.16 20.19,27.56 20.19,28.19 20.05,28.34 U2.10
GPS_TX
  Top 0.203: U3.10 21.95,37.57 21.84,37.47 21.84,36.58 24.13,34.29 24.13,25.4 JP21.4 20.32,24.13 20.32,26.67 20.15,26.84 U2.9
HV_CS
  Top 0.203: U3.17 25.75,39.97 26.42,40.64 26.42,41.02 27.69,42.29 JP17.1
  Bottom 0.203: SJ6.1 JP17.1
HV_MISO  (via drill 0.51)
  Top 0.203: U3.20 25.04,41.17 25.27,41.4 25.27,41.66 24.89,42.04 24.38,42.04 v24,42.42
  Bottom 0.203: SJ8.2 23.62,43.31 24,42.93 v24,42.42
HV_MOSI  (via drill 0.51)
  Top 0.203: U3.18 25.51,40.37 26.04,40.89 26.04,42.16 v23.88,44.32
  Bottom 0.203: SJ10.2 24.51,43.18 23.88,43.81 v23.88,44.32
HV_SCK  (via drill 0.51)
  Top 0.203: U3.19 25.28,40.77 25.65,41.15 25.65,41.91 24.26,43.31 21.21,43.31 v21.08,43.18
  Bottom 0.203: v21.08,43.18 SJ7.2
HW_RX
  Top 0.203: S2.1 46.7,37.81 JP13.1
  Top 0.254: JP13.1 J1.RX
HW_TX
  Top 0.203: S2.4 49.81,43.47 JP13.2
  Top 0.254: JP13.2 J1.TX
ICSP_MISO
  Bottom 0.203: J1.MISO 54.75,39.61 52.07,42.29 37.85,42.29 36.58,41.02 23.37,41.02 22.61,41.78 SJ8.1
ICSP_MOSI
  Bottom 0.203: SJ10.1 25.4,41.66 25.65,41.4 36.32,41.4 37.59,42.67 52.32,42.67 58.67,36.32 58.67,29.27 J1.MOSI
ICSP_SCK
  Bottom 0.203: J1.SCK 52.7,29.93 52.7,40.64 51.44,41.91 38.1,41.91 36.83,40.64 20.32,40.64 19.68,41.27 SJ7.1
IOREF  (via drill 0.51)
  Top 0.203: U3.16 25.98,39.57 26.63,40.22 C3.1
  Top 0.254: C3.1 28.74,40.22 v29.21,39.75 | J1.IOREF JP3.7
  Bottom 0.254: v29.21,39.75 29.21,38.61 27.94,37.34 25.91,37.34 24.77,36.2 24.77,10.79 JP3.7
  Bottom 0.305: SJ3.2 16.51,6.35 17.78,5.08 19.05,5.08 J1.IOREF
N$1
  Top 0.254: D1.A 2.96,48.26 R1.1
N$2
  Top 0.254: R4.2 2.93,49.56 D2.C
N$3
  Top 0.254: J1.A5 JP5.1
N$4
  Top 0.254: J1.A4 JP5.2
N$5
  Top 0.254: JP13.3 J1.D2
N$6
  Top 0.254: JP13.4 J1.D3
N$7
  Top 0.254: JP13.5 J1.D4
N$8
  Top 0.254: JP13.6 J1.D5
N$9
  Top 0.254: JP13.7 J1.D6
N$10
  Top 0.254: JP13.8 J1.D7
N$11
  Top 0.254: J1.A3 JP5.3
N$12
  Top 0.254: J1.A2 JP5.4
N$13
  Top 0.254: J1.A1 JP5.5
N$14
  Top 0.254: J1.A0 JP5.6
N$15  (via drill 0.51)
  Top 0.254: R1.2 4.66,45.94 4.45,45.72 v2.75,45.72
  Bottom 0.254: v2.75,45.72 SJ2.2
N$16
  Top 0.508: SJ1.2 JP1.10 JP1.9 JP1.8 JP1.7 JP1.6 JP1.5 JP1.4 JP1.3 JP1.2 JP1.1
N$17  (via drill 0.51)
  Top 0.203: D2.A v4.69,52.07
  Bottom 0.203: SJ9.1 3.94,51.32 v4.69,52.07
N$18  (via drill 0.51)
  Top 0.203: J2.RSV1 v7.04,35.51 | R2.1 v15.24,31.75
  Bottom 0.203: v7.04,35.51 10.79,31.75 v15.24,31.75
N$19  (via drill 0.51)
  Top 0.203: J2.RSV2 4.47,43.21 v3.81,42.55 | v15.24,33.66 R3.1
  Bottom 0.203: v3.81,42.55 2.54,41.27 2.54,38.1 3.81,36.83 7.62,36.83 10.79,33.66 v15.24,33.66
N$20
  Top 0.254: JP14.8 J1.AREF
N$21
  Top 0.254: JP14.9 J1.SDA
N$22
  Top 0.254: JP14.10 J1.SCL
N$24
  Top 0.254: J1.VIN JP3.1
N$121
  Top 0.203: S2.6 36.93,43.47 35.94,44.45 31.5,44.45 JP15.2
  Bottom 0.203: SJ5.2 JP15.2
N$122
  Top 0.203: S2.3 38.14,41.36 36.32,43.18 JP15.1
  Bottom 0.203: SJ4.2 JP15.1
PPS  (via drill 0.51)
  Top 0.203: U2.12 v0.76,26.84
  Bottom 0.203: v0.76,26.84 15.41,26.84 19.05,30.48 JP21.7
RX  (via drill 0.51)
  Top 0.203: S2.5 v40.64,39.37 | U3.12 26.29,37.97 26.67,37.59 33.53,37.59 v35.31,39.37
  Bottom 0.203: v40.64,39.37 v35.31,39.37
SD_MISO
  Top 0.203: J2.DO 8.69,42.11 9.63,41.17 U3.1
SD_MOSI
  Top 0.203: U3.3 11.79,40.37 9.13,37.71 J2.DI
SD_SCK
  Top 0.203: U3.2 9.4,40.77 8.54,39.91 J2.SCLK
TX  (via drill 0.51)
  Top 0.203: S2.2 39.66,37.81 v39.37,38.1 | U3.11 26.06,37.57 26.42,37.21 34.42,37.21 v35.31,38.1
  Bottom 0.203: v39.37,38.1 v35.31,38.1
V_BATT  (via drill 0.51)
  Top 0.254: v16.51,3.81 17.27,3.81 17.78,4.32 BAT1.PWR@1 | U2.4 20.03,19.34 JP21.2 | SJ11.2 v3.74,10.98
  Bottom 0.254: v16.51,3.81 13.84,6.48 13.84,10.98 | JP21.2 14.79,10.98 13.84,10.98 | v3.74,10.98 13.84,10.98

### Text on the board
Bottom: v20
tPlace: GPS / FIX | PWR | SCL | SDA | AREF | GND | D13 | D12 | D11 | D10 | D9 | D8 | D7 | D6 | D5 | D4 | D3 | D2 | D1 | D0 | µSD / CD | µSD-CS | GPS-TX | GPS-RX | SW-UART | HW-UART | GND | Reset | GND | PPS | EN | RX | TX | FIX | VBAT | 3V3 | 3.3V | GPS Logger Shield | 3V3 | 5V | Batt | IOREF | !RST! | 3V3 | 5V | GND | GND | VIN | A0 | A1 | A2 | A3 | A4 | A5
bPlace: GPS-LED | SCL | SDA | AREF | GND | D13 | D12 | D11 | D10 | D9 | D8 | D7 | D6 | D5 | D4 | D3 | D2 | D1 | D0 | PWR-LED | µSD / CD | SCK | MISO | MOSI | µSD-CS | GPS-TX | GPS-RX | SPI Select | GND | GND | PPS | MISO | EN | SCK | MOSI | RX | TX | FIX | VBAT | 3V3 | 5V/3.3V | IOREF-Sel | 5V | 3.3V | Battery supply / required for / operation! | IOREF | !RST! | 3V3 | 5V | GND | GND | VIN | A0 | A1 | A2 | A3 | A4 | A5
Measures: Units in inches
tDocu: Jim Lindblom | Based on a design by Aaron Weiss